# Altium schematic sheet 2002_USB.SchDoc
size A3; Author: Joao Marques Chaves; Organization: ETML-ES; Address1: Avenue Recordon 1; Address2: 1004 Lausanne; Address3: Switzerland; SheetNumber: 2; SheetTotal: 7; Version: C
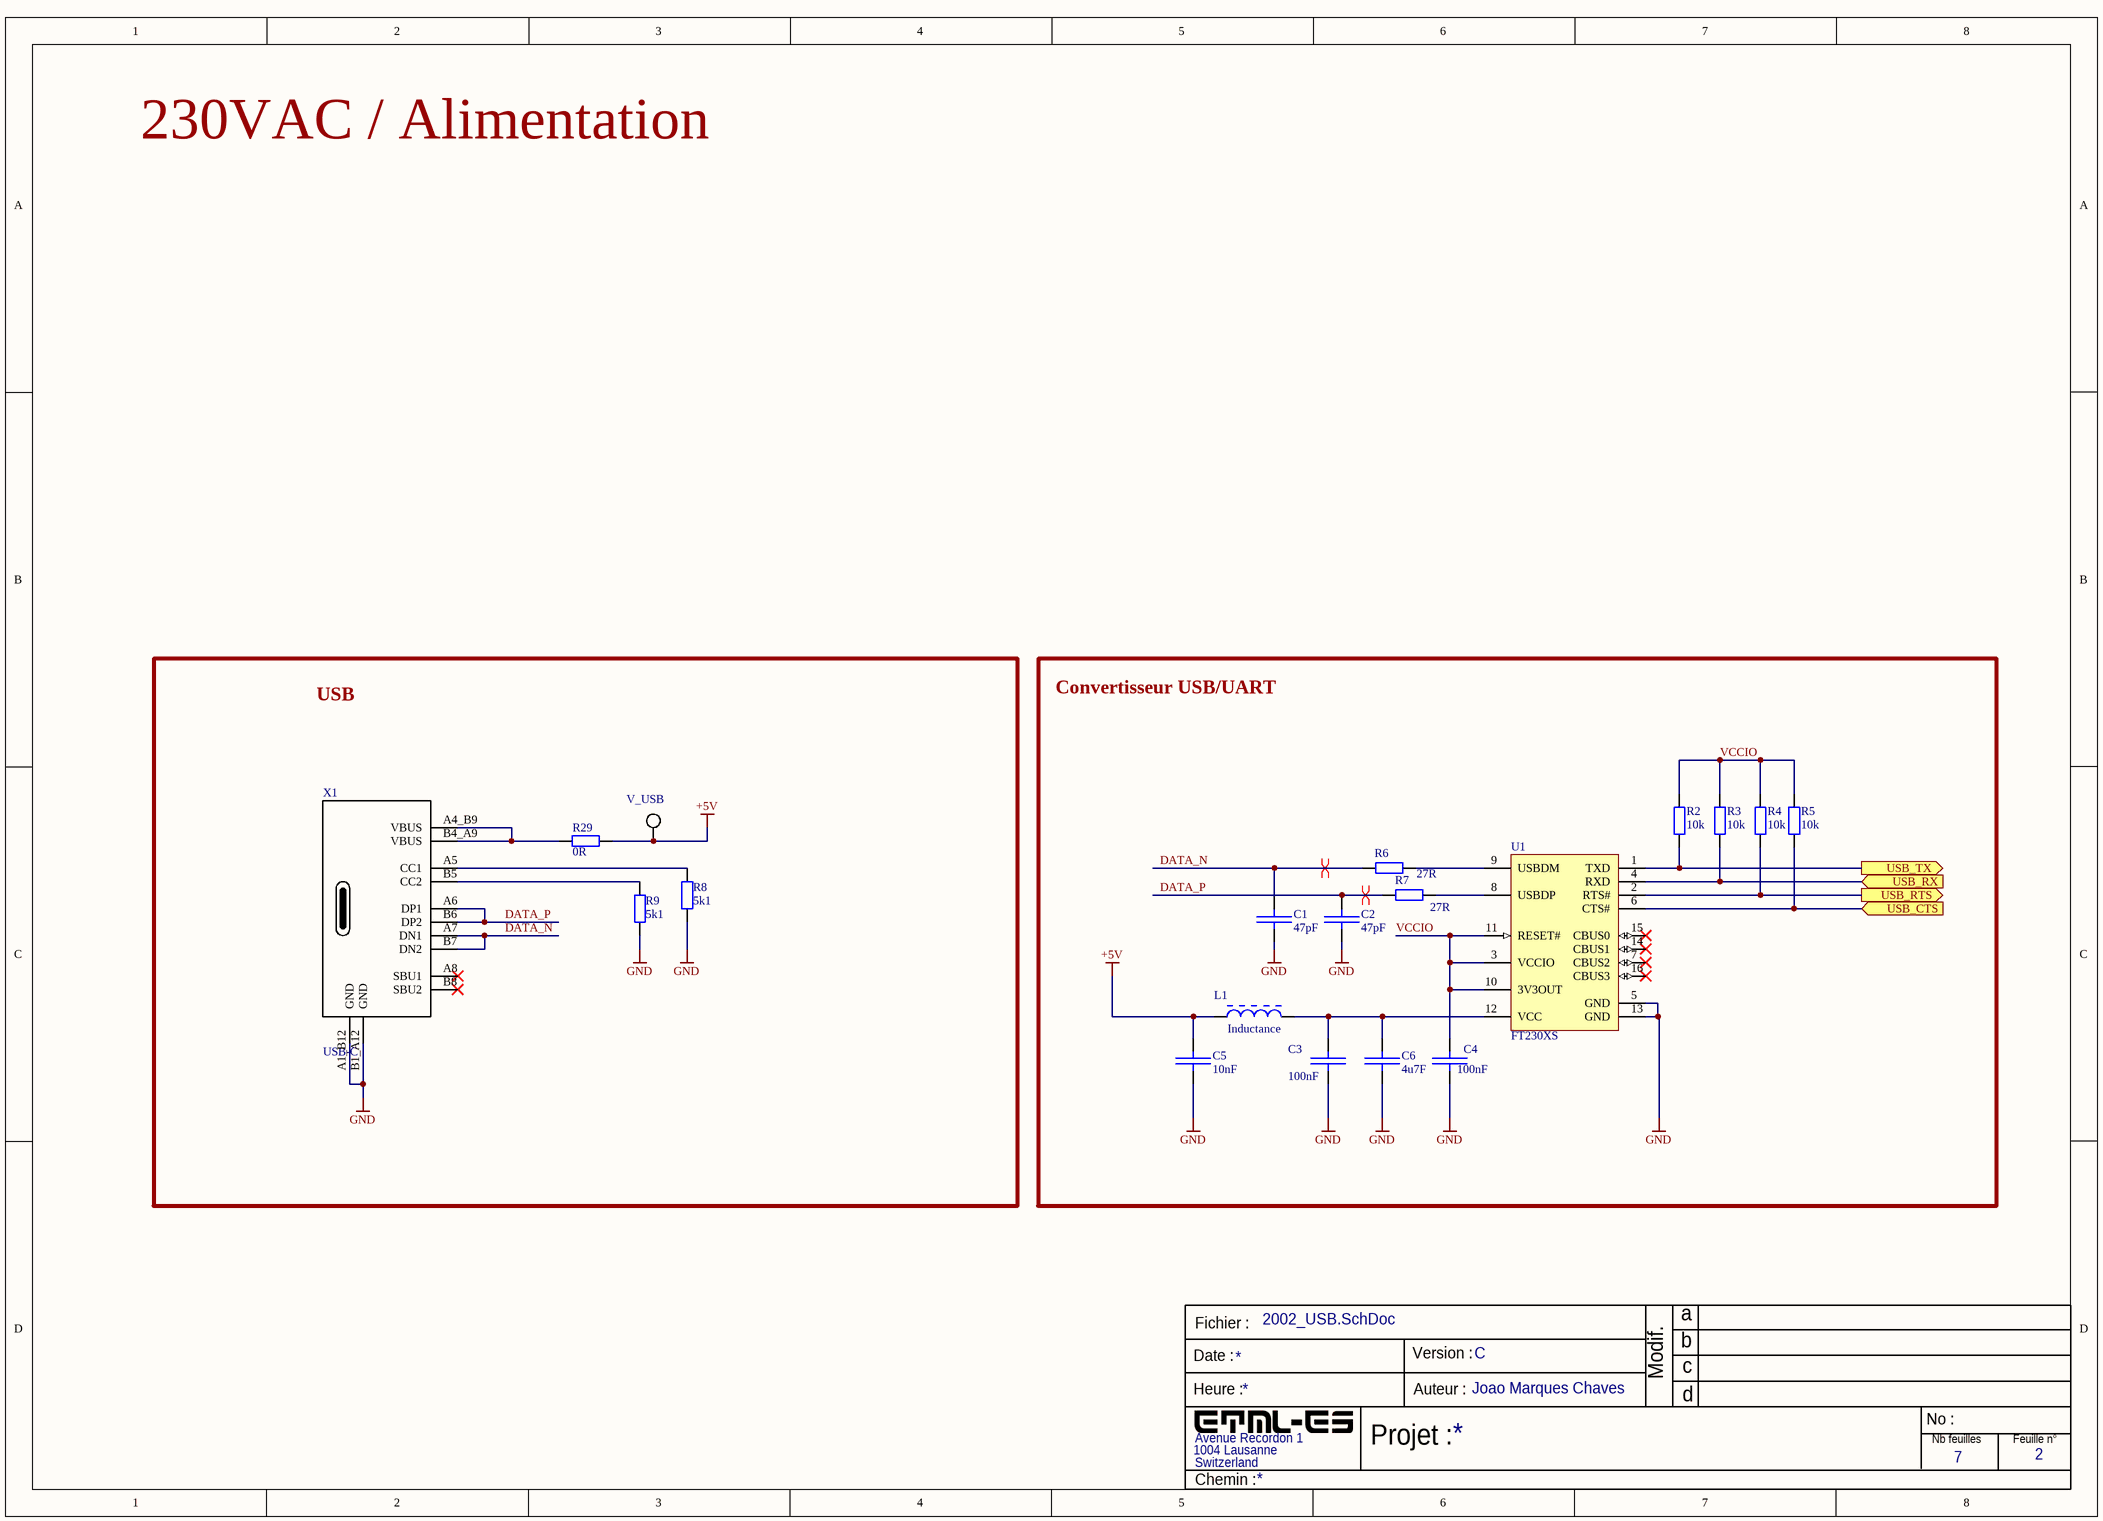
[diagram p0: 2002_USB.SchDoc]

## Parts
C1  47pF  [0805]
C2  47pF  [0805]
C3  100nF  [0805]
C4  100nF  [0805]
C5  10nF  [0805]
C6  4u7F  [0805]
L1  Inductance  [FB_MI0805K601R-10]
R2  10k  [0805]
R3  10k  [0805]
R4  10k  [0805]
R5  10k  [0805]
R6  27R  [0805]
R7  27R  [0805]
R8  5k1  [0805]
R9  5k1  [0805]
R29  0R  [0805]
U1  FT230XS  [FTDI-SSOP-16_L]
V_USB  5019  [TESTPOINT_SMD]  (value not drawn)
X1  USB-C  [GCT_USB4105-GF-A]

## Blocks framed on the sheet
USB: R8 R9 R29 V_USB X1
Convertisseur USB/UART: C1-C6 L1 R2-R7 U1

## Ports
USB_CTS (in), USB_RTS (out), USB_RX (in), USB_TX (out)

## Nets
+5V: C5.1 L1.1 R29.2 V_USB.1
GND: C1.2 C2.2 C3.2 C4.2 C5.2 C6.2 R8.1 R9.1 U1.5(GND) U1.13(GND) X1.A1_B12(GND) X1.B1_A12(GND)
DATA_N: C1.1 R6.1 X1.A7(DN1) X1.B7(DN2)
DATA_P: C2.1 R7.1 X1.A6(DP1) X1.B6(DP2)
USB_CTS: R5.1 U1.6(CTS#) ; port USB_CTS
USB_RTS: R4.1 U1.2(RTS#) ; port USB_RTS
USB_RX: R3.1 U1.4(RXD) ; port USB_RX
USB_TX: R2.1 U1.1(TXD) ; port USB_TX
VCCIO: C4.1 R2.2 R3.2 R4.2 R5.2 U1.3(VCCIO) U1.10(3V3OUT) U1.11(RESET#)
NetC3_1: C3.1 C6.1 L1.2 U1.12(VCC)
NetR6_2: R6.2 U1.9(USBDM)
NetR7_2: R7.2 U1.8(USBDP)
NetR8_2: R8.2 X1.A5(CC1)
NetR9_2: R9.2 X1.B5(CC2)
NetR29_1: R29.1 X1.A4_B9(VBUS) X1.B4_A9(VBUS)

Not connected (* = marked no-connect by the designer): U1 7(CBUS2)* 14(CBUS1)* 15(CBUS0)* 16(CBUS3)*; X1 A8(SBU1)* B8(SBU2)*

## Layout directives
differential pair: DATA_N, DATA_P

## Notes on the sheet
- 230VAC / Alimentation
- Fichier :
- a
- Date :
- Heure :
- Version :
- Auteur :
- Modif.
- b
- c
- d
- Projet :
- No :
- Nb feuilles
- Feuille n°
- Chemin :

## Library data of the parts
C1 C2 = Condensator: Value: 47pF
C3-C6 = Condensator: 0805 Condensator
  C3 C4: Value: 100nF
  C5: Value: 10nF
  C6: Value: 4u7F
L1 = CMP-2000-05196-1: MI0805K601R-10; Manufacturer: Laird; Filter Type: PowerLine; Current Rating (Max): 1.5A; Catalog Drawings: (HI,HZ,LI,MI)0805Series_1.10mmMax.Height; Impedance @ Frequency: 600Ohm@100MHz; Number of Lines: 1; DC Resistance (DCR) (Max): 100mOhm; Other Names: 240-2390-1; Kits: 240-2227-ND-KITEMIFERRITEBEADCHIPSMD; Online Catalog: MISeries; Standard Package: 1; Datasheet Version: Rev. A, 01/2004; Height (Max): 0.043"(1.10mm); Category: Filters; Operating Temperature: -40degC~125degC; Package Description: 2-Pin Surface Mount Device, Body 2 x 1.25 mm; Package / Case: 0805(2012Metric); Package Reference: MI0805K601R-10-2; Packaging: CutTape(CT); Ratings: -; Mounting Type: SurfaceMount; Datasheet URL: https://datasheet.ciiva.com/3082/mi0805k601r-10-a-vp-3082219.pdf; Size / Dimension: 0.079"Lx0.049"W(2.00mmx1.25mm); Family: FerriteBeadsandChips; Manufacturer URL: https://www.lairdtech.com; Series: MI; Supplier: Digikey; Supplier Ref.: 240-2390-1-ND; Supplier min. qty: 1; Supplier unit price: 0.11; ComponentLink1Description: distributeur; ComponentLink1URL: https://eu.mouser.com/ProductDetail/Laird-Performance-Materials/MI0805K601R-10?qs=bbdZqDPQhEXXIHxc191aOg%3D%3D; ComponentLink2Description: Datasheet; ComponentLink2URL: https://eu.mouser.com/datasheet/2/987/mi0805k601r_10_datasheet-2947150.pdf
R2-R5 = RES-0805: SMD Resistor; Resistance: 10k
R6 R7 = RES-0805: SMD Resistor 0805, 330Ω; Resistance: 27R
R8 R9 = CMP-2001-00528-1: Part Number: ERJ6ENF2703V; Manufacturer: Panasonic
R29 = Res2_1: Resistor; Published: 8-Jun-2000; LatestRevisionDate: 17-Jul-2002; LatestRevisionNote: Re-released for DXP Platform.; PackageReference: AXIAL-0.4; Publisher: Altium Limited; PackageDescription: Axial Device, Thru-Hole; 2 Leads; 0.4 in Pin Spacing; Value: 0R
U1 = CMP-2000-06288-1: USB to Basic UART IC, 2.97 to 5.5 V, -40 to 85 degC, 16-Pin SSOP, RoHS; Manufacturer: FTDI; Data Rate: 3Mbaud; USB Standard: USB2.0; USB Type: Transceiver; No. of Pins: 16Pins; Supply Voltage Max: 5.5V; SVHC: NoSVHC(17-Dec-2015); Supply Voltage Min: 2.97V; MSL: MSL3-168hours; Datasheet Version: Rev. 1.4, 05/2016; Interface Case Style: SSOP; Datasheet URL: http://www.ftdichip.com/Support/Documents/DataSheets/ICs/DS_FT230X.pdf; Packaging: CutTape; Package Description: 16-Pin Shrink Small Outline Package Integrated Circuit, Body 4.9 x 3.9 mm, Pitch 0.635 mm; Operating Temperature Min: -40°C; Mounting Technology: SurfaceMount; Package Reference: SSOP-16; Manufacturer URL: http://www.ftdichip.com/; Product Range: -; Operating Temperature Max: 85°C; No. of Ports: -; Supplier: Digikey; Supplier Ref.: 768-1135-1-ND; Supplier min. qty: 1; Supplier unit price: 2.00; ComponentLink1Description: distributeur; ComponentLink1URL: https://www.mouser.ch/ProductDetail/FTDI/FT230XS-R?qs=Gp1Yz1mis3XyCLeYOseSng%3D%3D; ComponentLink2Description: Datasheet; ComponentLink2URL: https://www.mouser.ch/datasheet/2/163/DS_FT230X-5395.pdf
V_USB = TESTPOINT: Test point smd
X1 = USB-C Type 2.0: U262-161N-4BVC11; ComponentLink1Description: LCSC  C319148; ComponentLink1URL: https://lcsc.com/product-detail/USB-Connectors_XKB-Connectivity-U262-161N-4BVC11_C319148.html; Supplier 1: LCSC; Supplier Part Number 1: C319148; ComponentLink2Description: Datasheet; ComponentLink2URL: https://eu.mouser.com/datasheet/2/837/Global_Connector_Technology_usb4105-3106202.pdf; ComponentLink3Description: distributeur; ComponentLink3URL: https://eu.mouser.com/ProductDetail/GCT/USB4105-GF-A?qs=KUoIvG%2F9IlY%2FMLlBMpStpA%3D%3D